# Altium schematic sheet Analog-Multiplier.SchDoc
size A4; DocumentNumber: 1; SheetNumber: 1; SheetTotal: 1
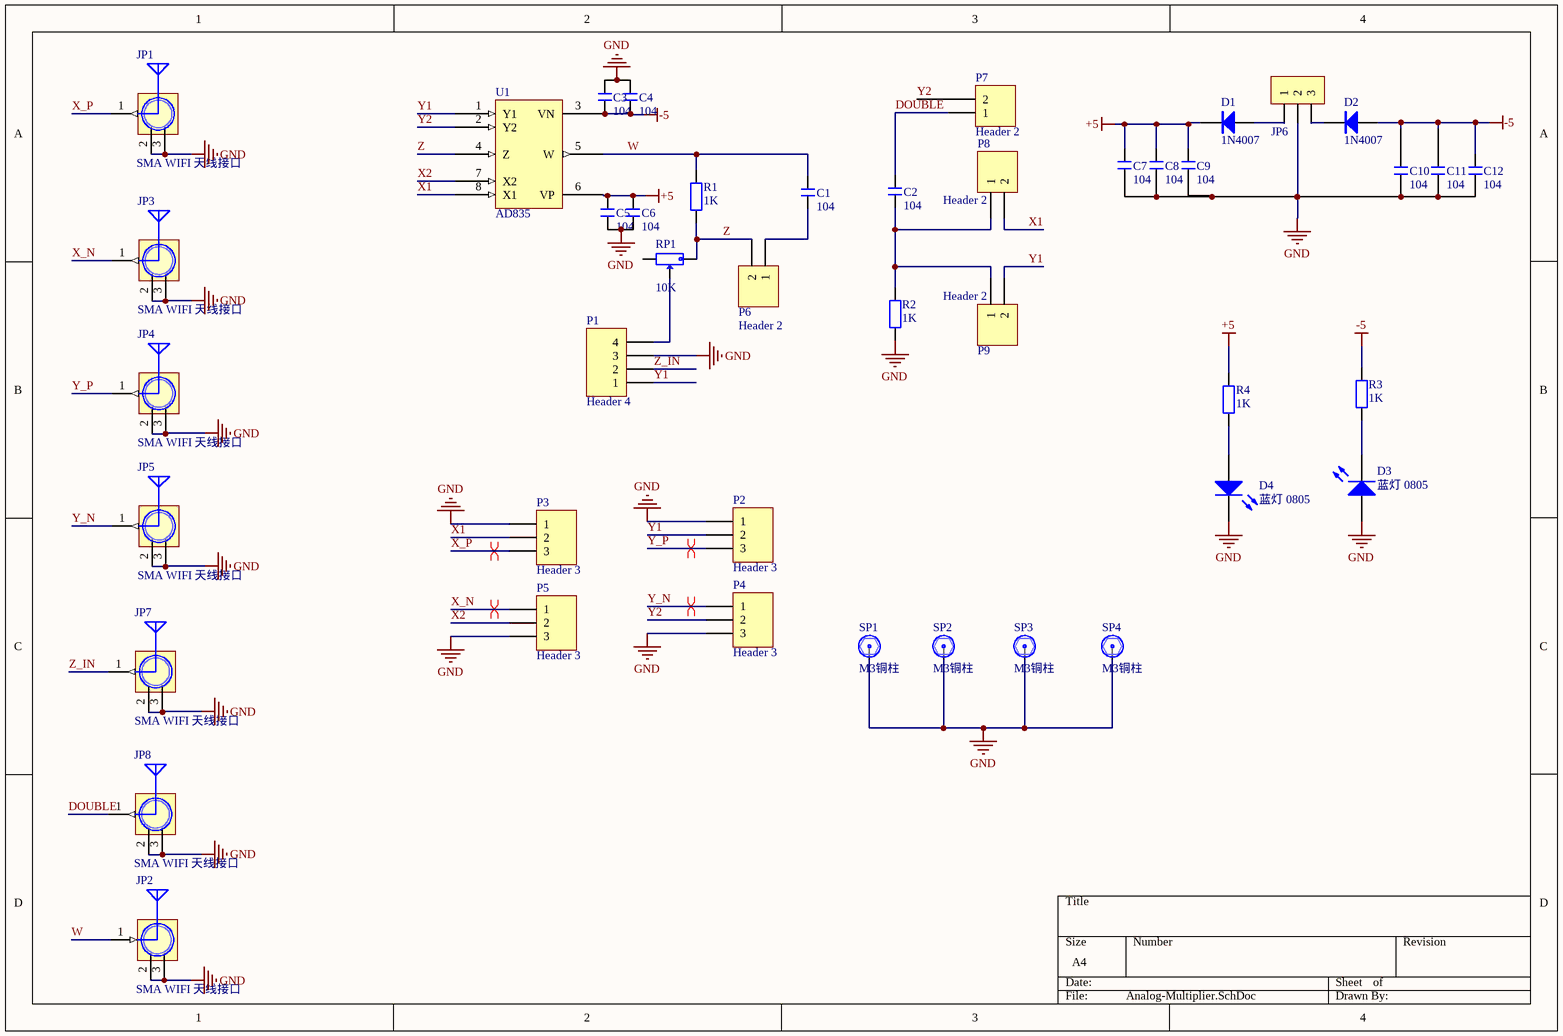
[diagram p0: Analog-Multiplier.SchDoc]

## Parts
C1  104  [C 0805_L]
C2  104  [C 0805_L]
C3  104  [C 0805_L]
C4  104  [C 0805_L]
C5  104  [C 0805_L]
C6  104  [C 0805_L]
C7  104  [C 1206_L]
C8  104  [C 1206_L]
C9  104  [C 1206_L]
C10  104  [C 1206_L]
C11  104  [C 1206_L]
C12  104  [C 1206_L]
D1  1N4007  [SMA]
D2  1N4007  [SMA]
D3  蓝灯 0805  [0805_LED_S1]
D4  蓝灯 0805  [0805_LED_S1]
JP1  SMA WIFI 天线接口  [SMA-KE]
JP2  SMA WIFI 天线接口  [SMA-KE]
JP3  SMA WIFI 天线接口  [SMA-KE]
JP4  SMA WIFI 天线接口  [SMA-KE]
JP5  SMA WIFI 天线接口  [SMA-KE]
JP6  HDR-1X3  [XH2.54-WS-3P]  (value not drawn)
JP7  SMA WIFI 天线接口  [SMA-KE]
JP8  SMA WIFI 天线接口  [SMA-KE]
P1  Header 4  [Cross4]
P2  Header 3  [HDR2.54-LI-3P]
P3  Header 3  [HDR2.54-LI-3P]
P4  Header 3  [HDR2.54-LI-3P]
P5  Header 3  [HDR2.54-LI-3P]
P6  Header 2  [HDR2.54-LI-2P]
P7  Header 2  [HDR2.54-LI-2P]
P8  Header 2  [HDR2.54-LI-2P]
P9  Header 2  [HDR2.54-LI-2P]
R1  1K  [R 0805_L]
R2  1K  [R 0805_L]
R3  1K  [R 0805_L]
R4  1K  [R 0805_L]
RP1  10K  [3296W]
SP1  M3铜柱  [M3x4_L]
SP2  M3铜柱  [M3x4_L]
SP3  M3铜柱  [M3x4_L]
SP4  M3铜柱  [M3x4_L]
U1  AD835  [SOP8_N]

## Nets
+5: C5.2 C6.2 C7.2 C8.2 C9.2 D1.2(K) R4.2 U1.6(VP)
-5: C3.2 C4.2 C10.2 C11.2 C12.2 D2.1(A) R3.2 U1.3(VN)
GND: C3.1 C4.1 C5.1 C6.1 C7.1 C8.1 C9.1 C10.1 C11.1 C12.1 D3.A D4.K JP1.2(GND) JP1.3(GND) JP2.2(GND) JP2.3(GND) JP3.2(GND) JP3.3(GND) JP4.2(GND) JP4.3(GND) JP5.2(GND) JP5.3(GND) JP6.2 JP7.2(GND) JP7.3(GND) JP8.2(GND) JP8.3(GND) P1.3 P2.1 P3.1 P4.3 P5.3 R2.1 SP1.1 SP2.1 SP3.1 SP4.1
DOUBLE: C2.2 JP8.1(ANT) P7.1
W: C1.2 JP2.1(ANT) R1.2 U1.5(W)
X1: P3.2 P8.2 U1.8(X1)
X2: P5.2 U1.7(X2)
X_N: JP3.1(ANT) P5.1
X_P: JP1.1(ANT) P3.3
Y1: P1.1 P2.2 P9.2 U1.1(Y1)
Y2: P4.2 P7.2 U1.2(Y2)
Y_N: JP5.1(ANT) P4.1
Y_P: JP4.1(ANT) P2.3
Z: P6.2 R1.1 RP1.1 U1.4(Z)
Z_IN: JP7.1(ANT) P1.2
NetC1_1: C1.1 P6.1
NetC2_1: C2.1 P8.1 P9.1 R2.2
NetD1_1: D1.1(A) JP6.1
NetD2_2: D2.2(K) JP6.3
NetD3_K: D3.K R3.1
NetD4_A: D4.A R4.1
NetP1_4: P1.4 RP1.2

Not connected (* = marked no-connect by the designer): RP1 3

## Layout directives
differential pair: X_N, X_P, Y_N, Y_P

## Library data of the parts
C1-C12 = C: 无极性贴片电容; 材质: X7R; BOM名称: 无极性贴片电容
D1 D2 = 1N4007: 整流二极管; BOM名称: 整流二极管
D3 D4 = 0805 蓝灯: 发光二极管; ComponentLink1Description: 供应商链接; ComponentLink1URL: http://www.szlcsc.com/product/details_2666.html; Package: 0805; Supplier: LC; SuppliersPartNumber: C2293
JP1-JP5 JP7 JP8 = SMA: SMA-2.4G射频天线接口; BOM名称: SMA-2.4G射频天线接口
JP6 = Header 3: 3P接插件; BOM名称: 3P接插件
P1 = Header 4: Header, 4-Pin; LatestRevisionDate: 17-Jul-2002; LatestRevisionNote: Re-released for DXP Platform.; Publisher: Altium Limited
P2-P5 = Header 3: Header, 3-Pin; LatestRevisionDate: 17-Jul-2002; LatestRevisionNote: Re-released for DXP Platform.; Publisher: Altium Limited
P6-P9 = Header 2: Header, 2-Pin; LatestRevisionDate: 17-Jul-2002; LatestRevisionNote: Re-released for DXP Platform.; Publisher: Altium Limited
R1-R4 = R: 贴片电阻; BOM名称: 贴片电阻
RP1 = RP-SMD: 贴片电位器; BOM名称: 贴片电位器
SP1-SP4 = 铜柱小焊盘: 铜柱; BOM名称: 铜柱